# EAGLE schematic RPi-Display_Bplus_v11 (EAGLE 6.6.0)
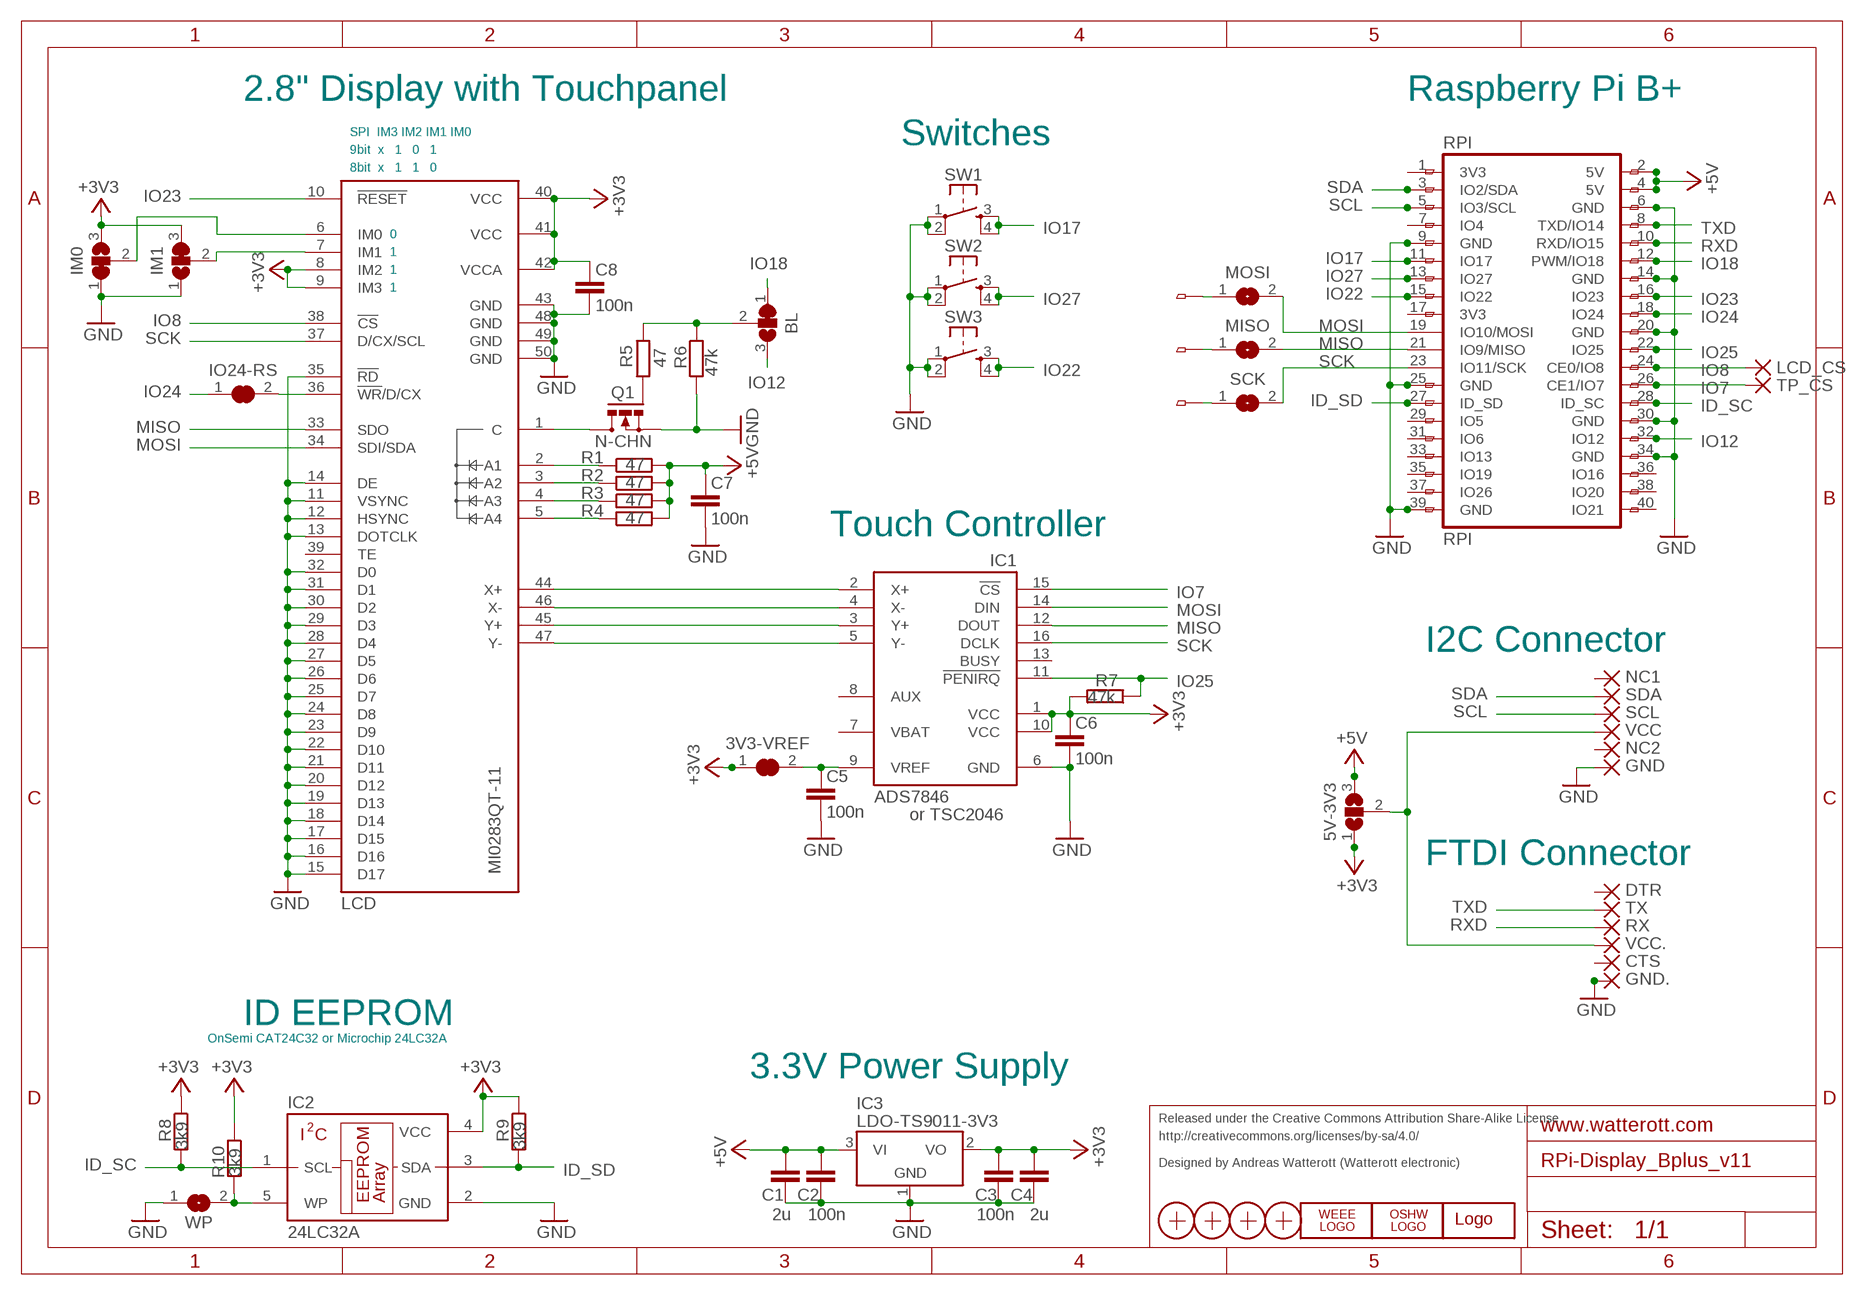
[diagram p0: schematic, sheet 1]

## Parts
3V3-VREF  JUMPER2-NOCREAM  [JUMPER2_NC]
5V-3V3  JUMPER3-NOCREAM  [JUMPER3_NC]
BL  JUMPER3-NOCREAM  [JUMPER3_NC]
C1  2u  C-EUC0603  [C0603]
C2  100n  C-EUC0603  [C0603]
C3  100n  C-EUC0603  [C0603]
C4  2u  C-EUC0603  [C0603]
C5  100n  C-EUC0603  [C0603]
C6  100n  C-EUC0603  [C0603]
C7  100n  C-EUC0603  [C0603]
C8  100n  C-EUC0603  [C0603]
CTS  PAD-1.27X2.54_NC  [PAD-1.27X2.54_NC]
DTR  PAD-1.27X2.54_NC  [PAD-1.27X2.54_NC]
GND  PAD-1.27X2.54_NC  [PAD-1.27X2.54_NC]
GND.  PAD-1.27X2.54_NC  [PAD-1.27X2.54_NC]
GPIO  FH12-40S-0.5SH  [FH12-40S-0.5SH]
IC1  ADS7846  [SSOP16]
IC2  24LC32A  I2C_EEPROM-CAT24AA0X  [SOT23-5]
IC3  LDO-TS9011-3V3  [SOT23]
IM0  JUMPER3-NOCREAM  [JUMPER3_NC]
IM1  JUMPER3-NOCREAM  [JUMPER3_NC]
IO24-RS  JUMPER2-NOCREAM  [JUMPER2_NC]
LCD  MI0283QT-11  [MI0283QT11]
LCD_CS  PAD-1.0_NC  [PAD-1.0_NC]
LOGO1  OSHW_LOGO_6MILX0150-NT  [OSHW_6X150_NOTEXT]
LOGO2  WEEE_LOGO  [WEEE]
MISO  JUMPER2-NOCREAM  [JUMPER2_NC]
MOSI  JUMPER2-NOCREAM  [JUMPER2_NC]
NC1  PAD-1.27X2.54_NC  [PAD-1.27X2.54_NC]
NC2  PAD-1.27X2.54_NC  [PAD-1.27X2.54_NC]
Q1  N-CHN  IRLML2502  [MICRO3]
R1  47  R-EU_R0603  [R0603]
R2  47  R-EU_R0603  [R0603]
R3  47  R-EU_R0603  [R0603]
R4  47  R-EU_R0603  [R0603]
R5  47  R-EU_R0603  [R0603]
R6  47k  R-EU_R0603  [R0603]
R7  47k  R-EU_R0603  [R0603]
R8  3k9  R-EU_R0603  [R0603]
R9  3k9  R-EU_R0603  [R0603]
R10  3k9  R-EU_R0603  [R0603]
RPI  RPI  RPI_B+  [RPI_B+]
RX  PAD-1.27X2.54_NC  [PAD-1.27X2.54_NC]
SCK  JUMPER2-NOCREAM  [JUMPER2_NC]
SCL  PAD-1.27X2.54_NC  [PAD-1.27X2.54_NC]
SDA  PAD-1.27X2.54_NC  [PAD-1.27X2.54_NC]
SW1  SWITCH-PTS840P  [SW_PTS840P]
SW2  SWITCH-PTS840P  [SW_PTS840P]
SW3  SWITCH-PTS840P  [SW_PTS840P]
TP_CS  PAD-1.0_NC  [PAD-1.0_NC]
TX  PAD-1.27X2.54_NC  [PAD-1.27X2.54_NC]
U$1  WE-LOGO  WE-LOGOPLACE  [WE-LOGO]
VCC  PAD-1.27X2.54_NC  [PAD-1.27X2.54_NC]
VCC.  PAD-1.27X2.54_NC  [PAD-1.27X2.54_NC]
WP  JUMPER2-NOCREAM  [JUMPER2_NC]
X1  PASSER  [PASSER]
X2  PASSER  [PASSER]
X3  PASSER  [PASSER]
X4  PASSER  [PASSER]

## Nets
+3V3: 3V3-VREF.1 5V-3V3.1 C3.1 C4.1 C6.1 C8.1 IC1.1(VCC) IC1.10(VCC) IC2.4(VCC) IC3.2(VO) IM0.3 IM1.3 LCD.8(IM2) LCD.9(IM3) LCD.40(VCC) LCD.41(VCC) LCD.42(VCCA) R7.2 R8.1 R9.1 R10.1
+5V: 5V-3V3.3 C1.1 C2.1 C7.1 GPIO.37 GPIO.39 IC3.3(VI) R1.2 R2.2 R3.2 R4.2 RPI.2(5V) RPI.4(5V)
BL: BL.2 R5.2 R6.1
C1: LCD.1(C) Q1.3(D)
GND: C1.2 C2.2 C3.2 C4.2 C5.2 C6.2 C7.2 C8.2 GND.1(P) GND..1(P) GPIO.2 GPIO.7 GPIO.11 GPIO.16 GPIO.21 GPIO.27 GPIO.32 GPIO.35 IC1.6(GND) IC2.2(GND) IC3.1(GND) IM0.1 IM1.1 LCD.11(VSYNC) LCD.12(HSYNC) LCD.13(DOTCLK) LCD.14(DE) LCD.15(D17) LCD.16(D16) LCD.17(D15) LCD.18(D14) LCD.19(D13) LCD.20(D12) LCD.21(D11) LCD.22(D10) LCD.23(D9) LCD.24(D8) LCD.25(D7) LCD.26(D6) LCD.27(D5) LCD.28(D4) LCD.29(D3) LCD.30(D2) LCD.31(D1) LCD.32(D0) LCD.35(!RD) LCD.43(GND) LCD.48(GND) LCD.49(GND) LCD.50(GND) Q1.2(S) R6.2 RPI.6(GND) RPI.9(GND) RPI.14(GND) RPI.20(GND) RPI.25(GND) RPI.30(GND) RPI.34(GND) RPI.39(GND) SW1.1(P) SW1.2(P1) SW2.1(P) SW2.2(P1) SW3.1(P) SW3.2(P1) WP.1
ID_SC: GPIO.13 IC2.1(SCL) R8.2 RPI.28(ID_SC)
ID_SD: GPIO.14 IC2.3(SDA) R9.2 RPI.27(ID_SD)
IM0: IM0.2 LCD.6(IM0)
IM1: IM1.2 LCD.7(IM1)
IO7: GPIO.15 IC1.15(!CS) RPI.26(CE1/IO7) TP_CS.1(P)
IO8: GPIO.17 LCD.38(!CS) LCD_CS.1(P) RPI.24(CE0/IO8)
IO12: BL.3 GPIO.9 RPI.32(IO12)
IO17: GPIO.30 RPI.11(IO17) SW1.3(S) SW1.4(S1)
IO18: BL.1 GPIO.29 RPI.12(PWM/IO18)
IO22: GPIO.26 RPI.15(IO22) SW3.3(S) SW3.4(S1)
IO23: GPIO.25 LCD.10(!RESET) RPI.16(IO23)
IO24: GPIO.23 IO24-RS.1 RPI.18(IO24)
IO25: GPIO.19 IC1.11(!PENIRQ) R7.1 RPI.22(IO25)
IO27: GPIO.28 RPI.13(IO27) SW2.3(S) SW2.4(S1)
LED_A1: LCD.2(A1) R1.1
LED_A2: LCD.3(A2) R2.1
LED_A3: LCD.4(A3) R3.1
LED_A4: LCD.5(A4) R4.1
LEDPWM: Q1.1(G) R5.1
MISO: IC1.12(DOUT) LCD.33(SDO) MISO.2 RPI.21(IO9/MISO)
MOSI: IC1.14(DIN) LCD.34(SDI/SDA) MOSI.2 RPI.19(IO10/MOSI)
N$1: IO24-RS.2 LCD.36(!WR!/D/CX)
N$2: IC2.5(WP) R10.2 WP.2
N$4: GPIO.22 MOSI.1
N$5: 5V-3V3.2 VCC.1(P) VCC..1(P)
N$6: GPIO.20 MISO.1
N$7: GPIO.18 SCK.1
N$8: GPIO.40 RPI.1(3V3)
N$9: GPIO.34 RPI.7(IO4)
N$13: GPIO.24 RPI.17(3V3)
N$15: GPIO.12 RPI.29(IO5)
N$16: GPIO.10 RPI.31(IO6)
N$17: GPIO.8 RPI.33(IO13)
N$18: GPIO.6 RPI.35(IO19)
N$19: GPIO.4 RPI.37(IO26)
N$27: GPIO.5 RPI.36(IO16)
N$28: GPIO.3 RPI.38(IO20)
N$29: GPIO.1 RPI.40(IO21)
RXD: GPIO.31 RPI.10(RXD/IO15) RX.1(P)
SCK: IC1.16(DCLK) LCD.37(D/CX/SCL) RPI.23(IO11/SCK) SCK.2
SCL: GPIO.36 RPI.5(IO3/SCL) SCL.1(P)
SDA: GPIO.38 RPI.3(IO2/SDA) SDA.1(P)
TXD: GPIO.33 RPI.8(TXD/IO14) TX.1(P)
VREF: 3V3-VREF.2 C5.1 IC1.9(VREF)
X+: IC1.2(X+) LCD.44(X+)
X-: IC1.4(X-) LCD.46(X-)
Y+: IC1.3(Y+) LCD.45(Y+)
Y-: IC1.5(Y-) LCD.47(Y-)
Unconnected: CTS.1(P) DTR.1(P) IC1.7(VBAT) IC1.8(AUX) IC1.13(BUSY) LCD.39(TE) NC1.1(P) NC2.1(P)

## Notes on the sheet
- 2.8" Display with Touchpanel | Raspberry Pi B+
- SPI  IM3 IM2 IM1 IM0
- Switches
- 9bit  x   1   0   1
- 8bit  x   1   1   0
- 0
- 1
- 1
- 1
- Touch Controller
- I2C Connector
- or TSC2046
- FTDI Connector
- ID EEPROM
- OnSemi CAT24C32 or Microchip 24LC32A
- 3.3V Power Supply
- Released under the Creative Commons Attribution Share-Alike License
- http://creativecommons.org/licenses/by-sa/4.0/
- Designed by Andreas Watterott (Watterott electronic)

## Library data of the parts
3V3-VREF IO24-RS MISO MOSI SCK WP = we-rcl:JUMPER2
5V-3V3 BL IM0 IM1 = we-rcl:JUMPER3
C1-C8 = rcl:C-EU: CAPACITOR, European symbol
CTS DTR GND GND. LCD_CS NC1 NC2 RX SCL SDA TP_CS TX VCC VCC. = we-rcl:PAD: Pads
GPIO = con-hirose:FH12-40S-0.5S: 0.5mm Pitch Connectors For FPC/FFC Source: Data sheet <http://www.hirose.co.jp/cataloge_hp/e58605370.pdf>; MPN: FH12-40S-0.5SH(55); OC_FARNELL: 1324556; OC_NEWARK: 34M6178
IC1 = Display:ADS7846: ADS7846 / TSC2046 Touch Screen Controller
IC2 = we-chip:I2C_EEPROM
IC3 = we-power:LDO: LDOs TS1117 800mA, Vin max 12V TS9011 250mA, Vin max 12V - compatible AP2210 300mA, Vin max 15V TS5204 150mA, Vin max 16V
LCD = we-opto:MI0283QT: Multi-Inno MIO283QT-9 / -11 Display (240x320) with Ilitek ILI9341 controller
LOGO1 = OSHW:OSHW_LOGO_6MIL
LOGO2 = we-symbol:WEEE_LOGO
Q1 = IRF-sot23:IRLML2502: N-Channel Power MOSFET
R1-R10 = rcl:R-EU_: RESISTOR, European symbol
RPI = we-board:RPI_B+: Raspberry Pi Model B+
SW1-SW3 = we-switch:SWITCH
U$1 = welectronic:WE-LOGO
X1-X4 = SMD:PASSER